# Altium project My电磁_V5.PrjPcb
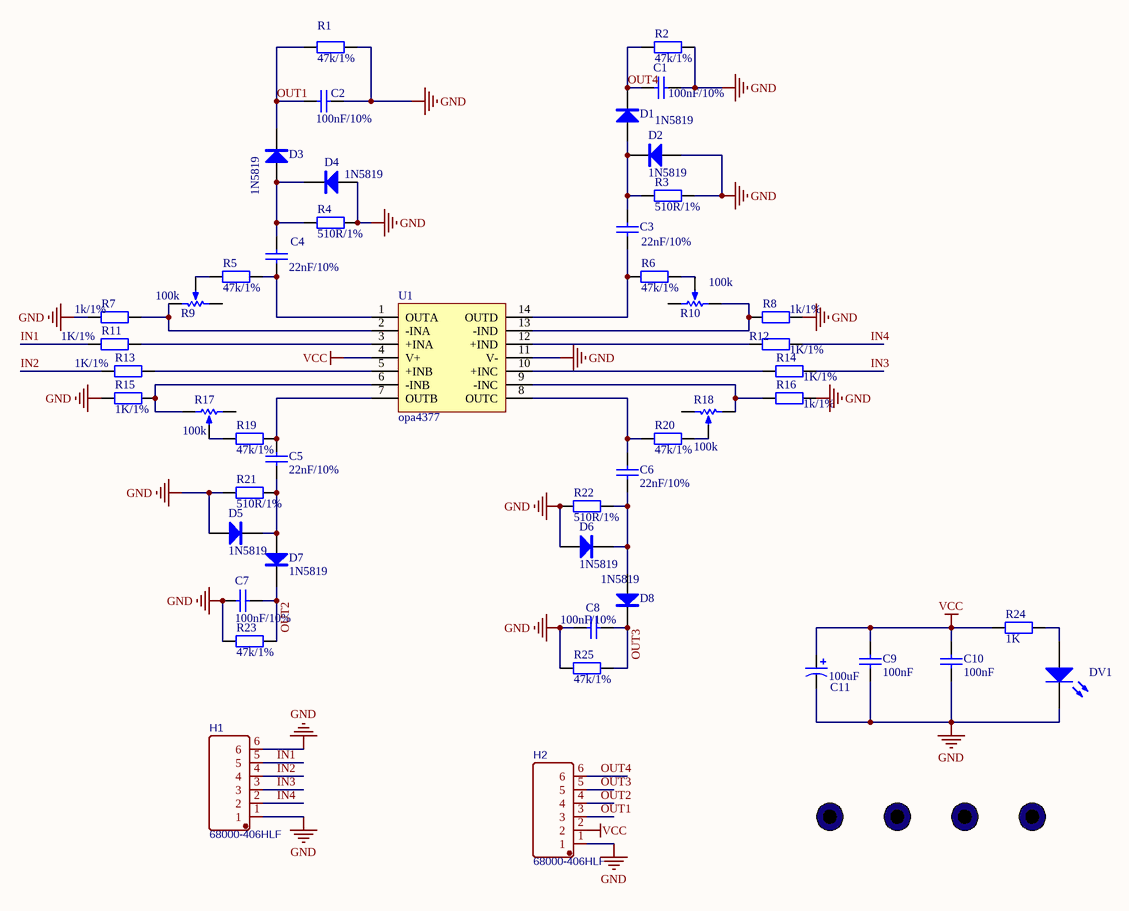
[diagram p0: My电磁_V5.SchDoc]
1 sheet, 52 parts. Net scope: global (net labels, ports and power ports of the same name join across sheets).
Board file: My电磁_V5.PcbDoc

## Sheet My电磁_V5.SchDoc
size A3

### Parts
C1  100nF/10%  [C 0805_L]
C2  100nF/10%  [C 0805_L]
C3  22nF/10%  [C 0805_L]
C4  22nF/10%  [C 0805_L]
C5  22nF/10%  [C 0805_L]
C6  22nF/10%  [C 0805_L]
C7  100nF/10%  [C 0805_L]
C8  100nF/10%  [C 0805_L]
C9  100nF  [C 0805_L]
C10  100nF  [C 0805_L]
C11  100uF  [CD A(3216)]
D1  1N5819  [SOD-323]
D2  1N5819  [SOD-323]
D3  1N5819  [SOD-323]
D4  1N5819  [SOD-323]
D5  1N5819  [SOD-323]
D6  1N5819  [SOD-323]
D7  1N5819  [SOD-323]
D8  1N5819  [SOD-323]
DV1  Red-0603  [LQ_LED0603R]  (value not drawn)
H1  68000-406HLF  [HDR-TH_6P-P2.54-V]
H2  68000-406HLF  [HDR-TH_6P-P2.54-V]
R1  value 47k/1%  [R 0805_L]  (hidden comment: Res2)
R2  value 47k/1%  [R 0805_L]  (hidden comment: Res2)
R3  value 510R/1%  [R 0805_L]  (hidden comment: Res2)
R4  value 510R/1%  [R 0805_L]  (hidden comment: Res2)
R5  value 47k/1%  [R 0805_L]  (hidden comment: Res2)
R6  value 47k/1%  [R 0805_L]  (hidden comment: Res2)
R7  value 1k/1%  [R 0805_L]  (hidden comment: Res2)
R8  value 1k/1%  [R 0805_L]  (hidden comment: Res2)
R9  100k  [电位计]
R10  100k  [电位计]
R11  value 1K/1%  [R 0805_L]  (hidden comment: Res2)
R12  value 1K/1%  [R 0805_L]  (hidden comment: Res2)
R13  value 1K/1%  [R 0805_L]  (hidden comment: Res2)
R14  value 1K/1%  [R 0805_L]  (hidden comment: Res2)
R15  value 1K/1%  [R 0805_L]  (hidden comment: Res2)
R16  value 1k/1%  [R 0805_L]  (hidden comment: Res2)
R17  100k  [电位计]
R18  100k  [电位计]
R19  value 47k/1%  [R 0805_L]  (hidden comment: Res2)
R20  value 47k/1%  [R 0805_L]  (hidden comment: Res2)
R21  value 510R/1%  [R 0805_L]  (hidden comment: Res2)
R22  value 510R/1%  [R 0805_L]  (hidden comment: Res2)
R23  value 47k/1%  [R 0805_L]  (hidden comment: Res2)
R24  value 1K  [R 0805_L]  (hidden comment: Res2)
R25  value 47k/1%  [R 0805_L]  (hidden comment: Res2)
SCROW1  SCROW  [LQ_SCROW3&5mm]  (value not drawn)
SCROW2  SCROW  [LQ_SCROW3&5mm]  (value not drawn)
SCROW3  SCROW  [LQ_SCROW3&5mm]  (value not drawn)
SCROW4  SCROW  [LQ_SCROW3&5mm]  (value not drawn)
U1  opa4377  [TSSOP-14]

### Nets
GND: C1.2 C2.1 C7.1 C8.1 C9.1 C10.1 C11.2 D2.1(A) D4.1(A) D5.1(A) D6.1(A) DV1.2(K) H1.1 H1.6 H2.1 R1.1 R2.2 R3.2 R4.1 R7.2 R8.2 R15.2 R16.2 R21.2 R22.2 R23.2 R25.2 U1.11(V-)
VCC: C9.2 C10.2 C11.1 H2.2 R24.2 U1.4(V+)
IN1: H1.5 R11.2
IN2: H1.4 R13.2
IN3: H1.3 R14.2
IN4: H1.2 R12.2
OUT1: C2.2 D3.2(K) H2.3 R1.2
OUT2: C7.2 D7.2(K) H2.4 R23.1
OUT3: C8.2 D8.2(K) H2.5 R25.1
OUT4: C1.1 D1.2(K) H2.6 R2.1
NetC3_1: C3.1 R6.1 U1.14(OUTD)
NetC3_2: C3.2 D1.1(A) D2.2(K) R3.1
NetC4_1: C4.1 R5.1 U1.1(OUTA)
NetC4_2: C4.2 D3.1(A) D4.2(K) R4.2
NetC5_1: C5.1 D5.2(K) D7.1(A) R21.1
NetC5_2: C5.2 R19.1 U1.7(OUTB)
NetC6_1: C6.1 D6.2(K) D8.1(A) R22.1
NetC6_2: C6.2 R20.1 U1.8(OUTC)
NetDV1_1: DV1.1(A) R24.1
NetR5_2: R5.2 R9.2(TAP)
NetR6_2: R6.2 R10.2(TAP)
NetR7_1: R7.1 R9.3(TOP) U1.2(-INA)
NetR8_1: R8.1 R10.3(TOP) U1.13(-IND)
NetR11_1: R11.1 U1.3(+INA)
NetR12_1: R12.1 U1.12(+IND)
NetR13_1: R13.1 U1.5(+INB)
NetR14_1: R14.1 U1.10(+INC)
NetR15_1: R15.1 R17.3(TOP) U1.6(-INB)
NetR16_1: R16.1 R18.3(TOP) U1.9(-INC)
NetR17_2: R17.2(TAP) R19.2
NetR18_2: R18.2(TAP) R20.2

Not connected (* = marked no-connect by the designer): R9 1(BOT); R10 1(BOT); R17 1(BOT); R18 1(BOT); SCROW1 1; SCROW2 1; SCROW3 1; SCROW4 1

### Library data of the parts
C1-C10 = Cap: Capacitor
C11 = CAP-AUX
D1-D8 = 1N5819: 肖特基二极管; 版权归属: 源创客; 属性: 40V/2A; BOM名称: 肖特基二极管; 学习资源: www.ooocke.com
DV1 = LED2: Typical RED, GREEN, YELLOW, AMBER GaAs LED; Published: 8-Jun-2000; LatestRevisionDate: 17-Jul-2002; LatestRevisionNote: Re-released for DXP Platform.; PackageVersion: Feb-2002; PackageReference: 3.2X1.6X1.1; Publisher: Altium Limited; PackageDescription: SM LED; 2 Flat Leads
H1 H2 = 68000-406HLF: BOM_Manufacturer: Amphenol ICC; Contributor: LCSC; BOM_Supplier: LCSC; BOM_Supplier Part: C178289; BOM_Manufacturer Part: 68000-406HLF; BOM_JLCPCB Part Class: Extended Part; spicePre: H; spiceSymbolName: 68000-406HLF
R1-R8 R11-R16 R19-R25 = R 0805: Resistor; Published: 8-Jun-2000; LatestRevisionDate: 17-Jul-2002; LatestRevisionNote: Re-released for DXP Platform.; PackageReference: AXIAL-0.4; Publisher: Altium Limited; PackageDescription: Axial Device, Thru-Hole; 2 Leads; 0.4 in Pin Spacing
R9 R10 R17 R18 = 电位器: 节电实验室
SCROW1-SCROW4 = SCROW: Connector